# Altium schematic sheet WS2811S.SchDoc
size A4
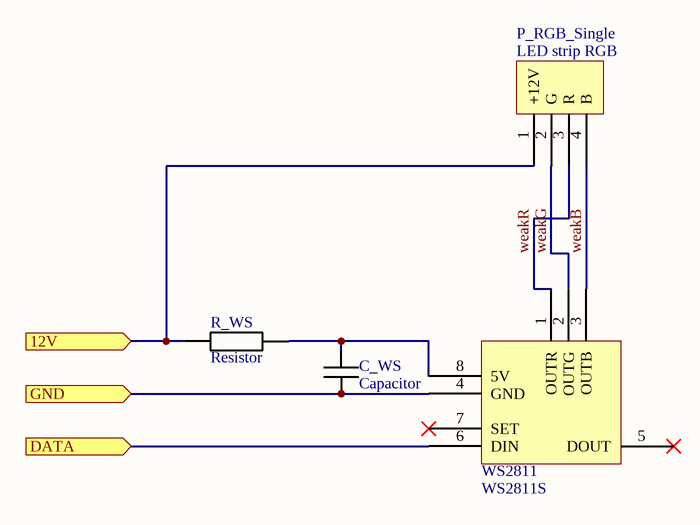
[diagram p0: WS2811S.SchDoc]

## Parts
C_WS  Capacitor  [0805-C]
P_RGB_Single  LED strip RGB  [LED strip RGB connector]
R_WS  Resistor  [0805-C wide]
WS2811  WS2811S  [SOIC-8]

## Ports
12V (in), DATA (in), GND (in)

## Nets
12V: P_RGB_Single.1(+12V) R_WS.1 ; port 12V
DATA: WS2811.6(DIN) ; port DATA
GND: C_WS.1 WS2811.4(GND) ; port GND
weakB: P_RGB_Single.4(B) WS2811.3(OUTB)
weakG: P_RGB_Single.2(G) WS2811.2(OUTG)
weakR: P_RGB_Single.3(R) WS2811.1(OUTR)
NetC_WS_2: C_WS.2 R_WS.2 WS2811.8(5V)

Not connected (* = marked no-connect by the designer): WS2811 5(DOUT)* 7(SET)*

## Library data of the parts
WS2811 = WS2811S: RGB LED Controller